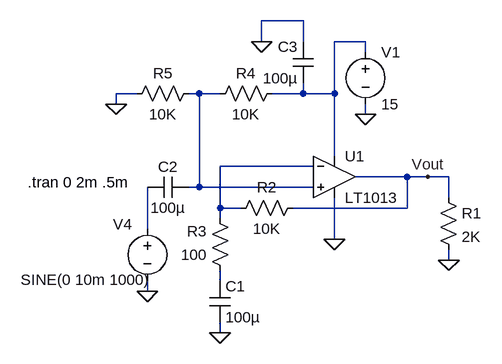
[diagram p0: schematic Opamp single supply.asc]
Opamp single supply.asc, the LTspice schematic file:
Version 4
SHEET 1 880 680
WIRE 192 -96 128 -96
WIRE 128 -64 128 -96
WIRE 192 -64 192 -96
WIRE 288 -64 240 -64
WIRE 288 -48 288 -64
WIRE -64 16 -96 16
WIRE 32 16 16 16
WIRE 64 16 32 16
WIRE 192 16 192 0
WIRE 192 16 144 16
WIRE 240 16 240 -64
WIRE 240 16 192 16
WIRE -96 32 -96 16
WIRE 288 48 288 32
WIRE 240 112 240 16
WIRE 208 128 64 128
WIRE 352 144 272 144
WIRE 384 144 352 144
WIRE 416 144 384 144
WIRE 32 160 32 16
WIRE 32 160 16 160
WIRE 208 160 32 160
WIRE 416 176 416 144
WIRE 64 192 64 128
WIRE 96 192 64 192
WIRE 352 192 352 144
WIRE 352 192 176 192
WIRE 64 208 64 192
WIRE -48 224 -48 160
WIRE 240 240 240 176
WIRE 416 272 416 256
WIRE 64 304 64 288
WIRE -48 320 -48 304
WIRE 64 384 64 368
FLAG 288 48 0
FLAG 240 240 0
FLAG 384 144 Vout
FLAG 416 272 0
FLAG -48 320 0
FLAG 64 384 0
FLAG -96 32 0
FLAG 128 -64 0
SYMBOL Opamps\\LT1013 240 80 R0
SYMATTR InstName U1
SYMBOL voltage 288 -64 R0
WINDOW 123 0 0 Left 2
WINDOW 39 0 0 Left 2
SYMATTR InstName V1
SYMATTR Value 15
SYMBOL res 400 160 R0
SYMATTR InstName R1
SYMATTR Value 2K
SYMBOL voltage -48 208 R0
WINDOW 0 -53 9 Left 2
WINDOW 3 -195 94 Left 2
WINDOW 123 0 0 Left 2
WINDOW 39 0 0 Left 2
SYMATTR InstName V4
SYMATTR Value SINE(0 10m 1000)
SYMBOL res 192 176 R90
WINDOW 0 0 56 VBottom 2
WINDOW 3 32 56 VTop 2
SYMATTR InstName R2
SYMATTR Value 10K
SYMBOL res 80 304 R180
WINDOW 0 36 76 Left 2
WINDOW 3 36 40 Left 2
SYMATTR InstName R3
SYMATTR Value 100
SYMBOL cap 48 304 R0
SYMATTR InstName C1
SYMATTR Value 100µ
SYMBOL cap 16 144 R90
WINDOW 0 0 32 VBottom 2
WINDOW 3 32 32 VTop 2
SYMATTR InstName C2
SYMATTR Value 100µ
SYMBOL cap 208 0 R180
WINDOW 0 24 56 Left 2
WINDOW 3 24 8 Left 2
SYMATTR InstName C3
SYMATTR Value 100µ
SYMBOL res 160 0 R90
WINDOW 0 0 56 VBottom 2
WINDOW 3 32 56 VTop 2
SYMATTR InstName R4
SYMATTR Value 10K
SYMBOL res 32 0 R90
WINDOW 0 0 56 VBottom 2
WINDOW 3 32 56 VTop 2
SYMATTR InstName R5
SYMATTR Value 10K
TEXT -232 152 Left 2 !.tran 0 2m .5m

The netlist it stands for:
* Opamp single supply.asc
XU1 N002 N003 N001 0 Vout LT1013  ; pins In+ In- V+ V- OUT
V1 N001 0 15
R1 Vout 0 2K
V4 N004 0 SINE(0 10m 1000)
R2 Vout N003 10K
R3 N005 N003 100
C1 N005 0 100µ
C2 N002 N004 100µ
C3 N001 0 100µ
R4 N001 N002 10K
R5 N002 0 10K
.tran 0 2m .5m
.lib LTC.lib
.backanno
.end